# Altium schematic sheet Kajtuś-DSP_sample_rate_converter.SchDoc
size A4; DocumentNumber: 6; SheetNumber: 6; SheetTotal: 9
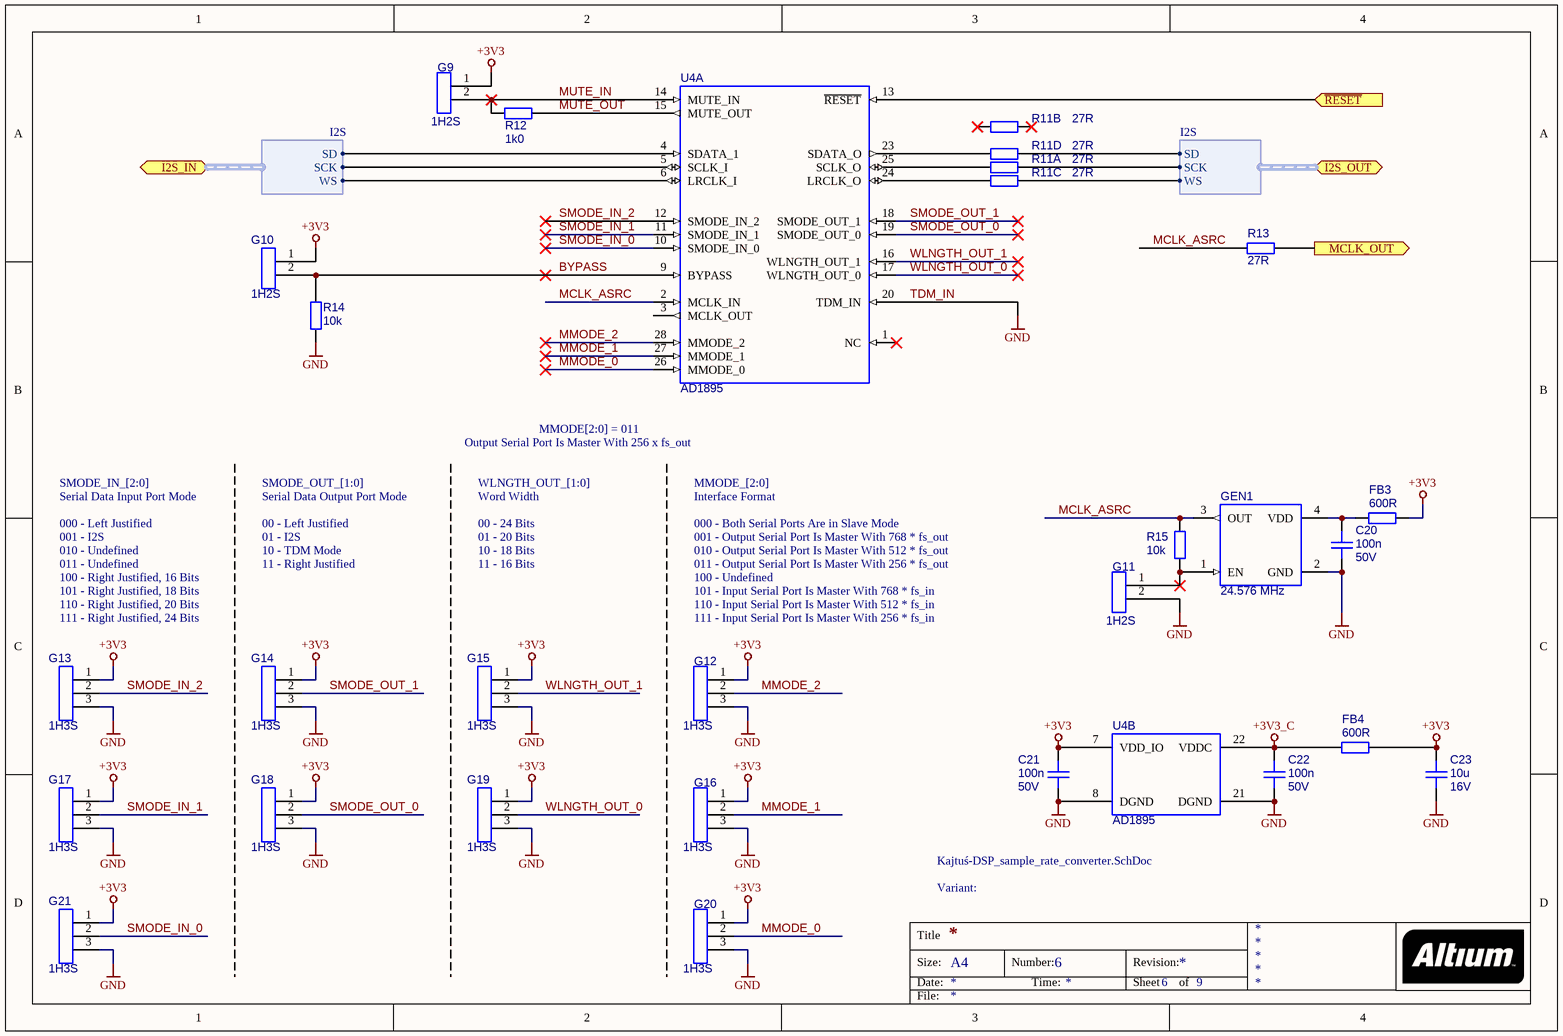
[diagram p0: Kajtuś-DSP_sample_rate_converter.SchDoc]

## Parts
C20  value 100n  Voltage: 50V  [C_0603_MA]  (hidden comment: C_0603_100n_50V_X7R)
C21  value 100n  Voltage: 50V  [C_0603_MA]  (hidden comment: C_0603_100n_50V_X7R)
C22  value 100n  Voltage: 50V  [C_0603_MA]  (hidden comment: C_0603_100n_50V_X7R)
C23  value 10u  Voltage: 16V  [C_0805_MA]  (hidden comment: C_0805_10u_16V_X5R)
FB3  value 600R  [R_0603_MA]  (hidden comment: FB_0603_PBY160808T-601Y_600R_1A)
FB4  value 600R  [R_0603_MA]  (hidden comment: FB_0603_PBY160808T-601Y_600R_1A)
G9  value 1H2S  [1H2S_FHS]  (hidden comment: G_1H2S)
G10  value 1H2S  [1H2S_FHS]  (hidden comment: G_1H2S)
G11  value 1H2S  [1H2S_FHS]  (hidden comment: G_1H2S)
G12  value 1H3S  [1H3S_FHS]  (hidden comment: G_1H3S)
G13  value 1H3S  [1H3S_FHS]  (hidden comment: G_1H3S)
G14  value 1H3S  [1H3S_FHS]  (hidden comment: G_1H3S)
G15  value 1H3S  [1H3S_FHS]  (hidden comment: G_1H3S)
G16  value 1H3S  [1H3S_FHS]  (hidden comment: G_1H3S)
G17  value 1H3S  [1H3S_FHS]  (hidden comment: G_1H3S)
G18  value 1H3S  [1H3S_FHS]  (hidden comment: G_1H3S)
G19  value 1H3S  [1H3S_FHS]  (hidden comment: G_1H3S)
G20  value 1H3S  [1H3S_FHS]  (hidden comment: G_1H3S)
G21  value 1H3S  [1H3S_FHS]  (hidden comment: G_1H3S)
GEN1  24.576 MHz  [GEN_5.0x3.2]
R11  27R  [RA_1206]  (parts A,B,C,D of 4)
R12  value 1k0  [R_0603_MA]  (hidden comment: R_0603_1k0_5%)
R13  value 27R  [R_0603_MA]  (hidden comment: R_0603_27R_5%)
R14  value 10k  [R_0603_MA]  (hidden comment: R_0603_10k_5%)
R15  value 10k  [R_0603_MA]  (hidden comment: R_0603_10k_5%)
U4  AD1895  [SSOP-28]  (parts A,B of 2)

## Ports
I2S_IN (harness I2S), I2S_OUT (harness I2S), MCLK_OUT (out), ~{RESET} (in)

## Harnesses
I2S: SD, SCK, WS

## Nets
+3V3: C21.1 C23.1 FB3.2 FB4.2 G9.1 G10.1 G12.1 G13.1 G14.1 G15.1 G16.1 G17.1 G18.1 G19.1 G20.1 G21.1 U4.7(VDD_IO)
+3V3_C: C22.1 FB4.1 U4.22(VDDC)
TDM_IN: C20.2 C21.2 C22.2 C23.2 G11.2 G12.3 G13.3 G14.3 G15.3 G16.3 G17.3 G18.3 G19.3 G20.3 G21.3 GEN1.2(GND) R14.2 U4.8(DGND) U4.20(TDM_IN) U4.21(DGND)  [also labelled GND]
BYPASS: G10.2 R14.1 U4.9(BYPASS)
MCLK_ASRC: GEN1.3(OUT) R13.1 R15.1 U4.2(MCLK_IN)
MCLK_OUT: R13.2 ; port MCLK_OUT
MMODE_0: G20.2 U4.26(MMODE_0)
MMODE_1: G16.2 U4.27(MMODE_1)
MMODE_2: G12.2 U4.28(MMODE_2)
MUTE_IN: G9.2 R12.1 U4.14(MUTE_IN)
MUTE_OUT: R12.2 U4.15(MUTE_OUT)
~{RESET}: U4.13(~{RESET}) ; port ~{RESET}
SMODE_IN_0: G21.2 U4.10(SMODE_IN_0)
SMODE_IN_1: G17.2 U4.11(SMODE_IN_1)
SMODE_IN_2: G13.2 U4.12(SMODE_IN_2)
SMODE_OUT_0: G18.2 U4.19(SMODE_OUT_0)
SMODE_OUT_1: G14.2 U4.18(SMODE_OUT_1)
WLNGTH_OUT_0: G19.2 U4.17(WLNGTH_OUT_0)
WLNGTH_OUT_1: G15.2 U4.16(WLNGTH_OUT_1)
NetC20_1: C20.1 FB3.1 GEN1.4(VDD)
NetG11_1: G11.1 GEN1.1(EN) R15.2
NetR11_1: R11.1 U4.25(SCLK_O)
NetR11_3: R11.3 U4.24(LRCLK_O)
NetR11_4: R11.4 U4.23(SDATA_O)
NetR11_5: R11.5 ; port I2S_OUT.SCK
NetR11_7: R11.7 ; port I2S_OUT.WS
NetR11_8: R11.8 ; port I2S_OUT.SD
NetU4_4: U4.4(SDATA_1) ; port I2S_IN.SD
NetU4_5: U4.5(SCLK_I) ; port I2S_IN.SCK
NetU4_6: U4.6(LRCLK_I) ; port I2S_IN.WS

Not connected (* = marked no-connect by the designer): R11 2* 6*; U4 1(NC)* 3(MCLK_OUT)

## Notes on the sheet
- Output Serial Port Is Master With 256 x fs_out
- MMODE[2:0] = 011
- SMODE_IN_[2:0]
- Serial Data Input Port Mode
- SMODE_OUT_[1:0]
- Serial Data Output Port Mode
- WLNGTH_OUT_[1:0]
- Word Width
- MMODE_[2:0]
- Interface Format
- 000 - Left Justified
- 001 - I2S
- 010 - Undefined
- 011 - Undefined
- 100 - Right Justified, 16 Bits
- 00 - Left Justified
- 01 - I2S
- 10 - TDM Mode
- 11 - Right Justified
- 00 - 24 Bits
- 01 - 20 Bits
- 10 - 18 Bits
- 11 - 16 Bits
- 000 - Both Serial Ports Are in Slave Mode
- 001 - Output Serial Port Is Master With 768 * fs_out
- 010 - Output Serial Port Is Master With 512 * fs_out
- 011 - Output Serial Port Is Master With 256 * fs_out
- 100 - Undefined
- 101 - Right Justified, 18 Bits
- 110 - Right Justified, 20 Bits
- 111 - Right Justified, 24 Bits
- 101 - Input Serial Port Is Master With 768 * fs_in
- 110 - Input Serial Port Is Master With 512 * fs_in
- 111 - Input Serial Port Is Master With 256 * fs_in
- Variant:
- Title
- Size:
- Date:
- A4
- Number:
- Time:
- Revision:
- Sheet
- of
- File:

## Library data of the parts
C20-C22 = C_0603_100n_50V_X7R: Kondensator ceramiczny SMD; Vendor: TME; Part Number: C_0603_100n_50V_X7R
C23 = C_0805_10u_16V_X5R: Kondensator ceramiczny SMD; Vendor: TME; Part Number: C_0805_10u_16V_X5R
FB3 FB4 = FB_0603_PBY160808T-601Y_600R_1A: Koralik ferrytowy; Manufacturer: Yageo; Vendor: TME; @ Frequency: @ 100 MHz; Part Number: FB_0603_PBY160808T-601Y_600R_1A; Vendor Part Name: PBY160808T-601Y; Manufacturer Part Number: PBY160808T-601Y
G9-G11 = G_1H2S: Listwa jednorzędowa, 1x2 piny, raster 2,54mm; Manufacturer: generic; Vendor: TME; Part Number: G_1H2S
G12-G21 = G_1H3S: Listwa jednorzędowa, 1x3 piny, raster 2,54mm; Manufacturer: generic; Vendor: TME; Part Number: G_1H3S
GEN1 = GEN_5.0x3.2_ASFL1-24.576MHZ-EK-T: 3.3V HCMOS/TTL Compatible SMD Crystal Clock Oscillator; Manufacturer: Abracon; Part Number: GEN_5.0x3.2_ASFL1-24.576MHZ-EK-T; Value: 24.576 MHz
R11 = RA_1206_4x27R_5%: SMD Resistor Array, 1206, 4x27R, 5%, 62.5mW; Parametry: 4x27R; 5%; 1/16W;; Producent: Yageo; Oznaczenie: YC164-JR0727RL; TCR: 200ppm; Package: 1206, YC164; Tolerance: 5%; Value: 27R
R12 = R_0603_1k0_5%: Rezystor SMD; Manufacturer: Royal Ohm; Vendor: TME; Tolerance: 5%; Part Number: R_0603_1k0_5%
R13 = R_0603_27R_5%: Rezystor SMD; Manufacturer: Royal Ohm; Vendor: TME; Tolerance: 5%; Part Number: R_0603_27R_5%
R14 R15 = R_0603_10k_5%: Rezystor SMD; Manufacturer: Royal Ohm; Vendor: TME; Tolerance: 5%; Part Number: R_0603_10k_5%
U4 = U_AD1895: 192 kHz Stereo Asynchronous Sample Rate Converter; Manufacturer: Analog Devices; Manufacturer Part Number: AD1895; Package: SSOP-28